# EAGLE schematic mp28164-buck-boost-flashlight-driver-tester-mk-2.1.0 (EAGLE 9.2.2)
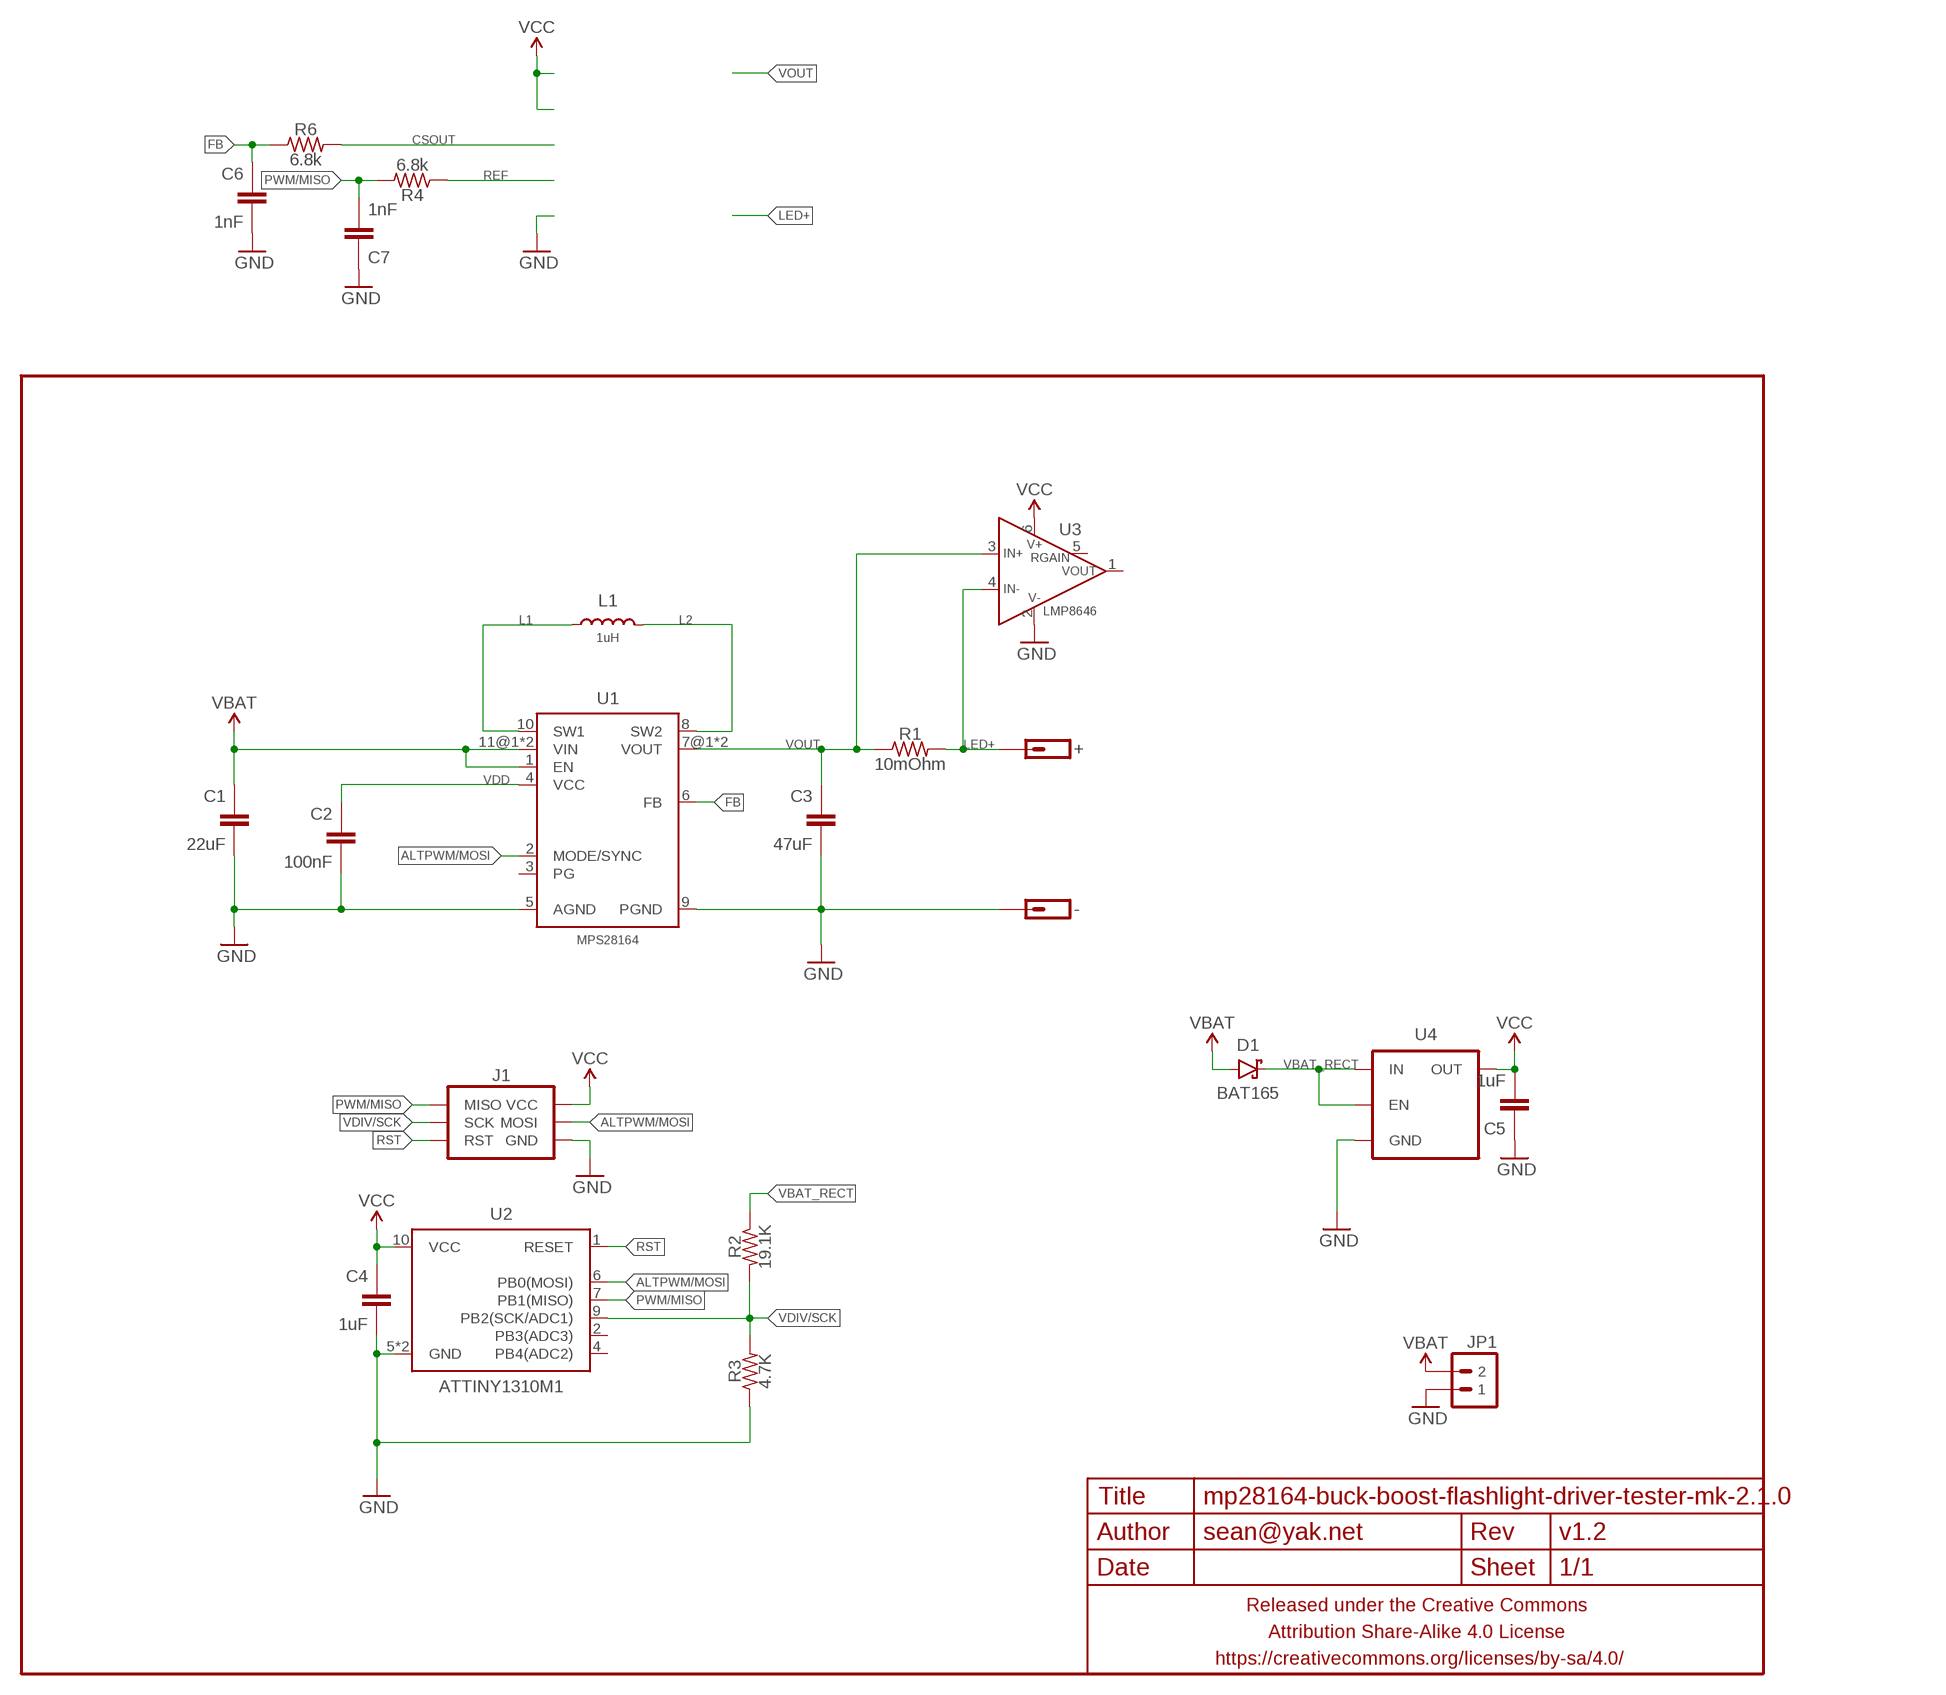
[diagram p0: schematic, sheet 1]

## Parts
+  M01PTH-1.2MM-NS  [1X01-1.2MM-NS]
-  M01PTH-1.2MM-NS  [1X01-1.2MM-NS]
C1  22uF  CAPACITOR-CERAMICC1206  [C1206]
C2  100nF  CAPACITOR-CERAMICC0402  [C0402]
C3  47uF  CAPACITOR-CERAMICC1206  [C1206]
C4  1uF  CAPACITOR-CERAMICC0402  [C0402]
C5  1uF  CAPACITOR-CERAMICC0402  [C0402]
C6  1nF  CAPACITOR-CERAMICC0402  [C0402]
C7  1nF  CAPACITOR-CERAMICC0402  [C0402]
D1  BAT165  DIODE-SCHOTTKYSOD323  [SOD323-SCHOTTKY]
FRAME1  FRAME-LETTERNO_PACKAGE  [DUMMY]
J1  AVR_SPI_PRG_6PTH  [2X3]
JP1  M02PTH-CENTERED  [1X02-CENTER]
L1  1uH  INDUCTORXAL60XX  [XAL60XX]
R1  10mOhm  RESISTORR1206  [R1206]
R2  19.1K  RESISTORR0402  [R0402]
R3  4.7K  RESISTORR0402  [R0402]
R4  6.8k  RESISTORR0402  [R0402]
R6  6.8k  RESISTORR0402  [R0402]
U1  MPS28164  [MPS28164]
U2  ATTINY1310M1  [QFN10(2X5)]
U3  LMP8646  [SOT23-6]
U4  V_REG_ENTLV700  [SC70]

## Nets
ALTPWM/MOSI: J1.4(MOSI) U1.2(MODE/SYNC) U2.6(PB0(MOSI))
CSOUT: R6.2
FB: C6.1 R6.1 U1.6(FB)
GND: -.P$1 C1.2 C2.2 C3.2 C4.2 C5.1 C6.2 C7.1 J1.6(GND) JP1.1 R3.1 U1.5(AGND) U1.9(PGND) U2.5(GND) U2.PAD(GND) U3.2(V-) U4.2(GND)
L1: L1.P$1 U1.10(SW1)
L2: L1.P$2 U1.8(SW2)
LED+: +.P$1 R1.2 U3.4(IN-)
PWM/MISO: C7.2 J1.1(MISO) R4.2 U2.7(PB1(MISO))
REF: R4.1
RST: J1.5(RST) U2.1(RESET)
VBAT: C1.1 D1.A JP1.2 U1.1(EN) U1.11@1(VIN) U1.11@2(VIN)
VBAT_RECT: D1.C R2.1 U4.1(IN) U4.3(EN)
VCC: C4.1 C5.2 J1.2(VCC) U2.10(VCC) U3.6(V+) U4.5(OUT)
VDD: C2.1 U1.4(VCC)
VDIV/SCK: J1.3(SCK) R2.2 R3.2 U2.9(PB2(SCK/ADC1))
VOUT: C3.1 R1.1 U1.7@1(VOUT) U1.7@2(VOUT) U3.3(IN+)
Unconnected: U1.3(PG) U2.2(PB3(ADC3)) U2.4(PB4(ADC2)) U3.1(VOUT) U3.5(RGAIN)

## Library data of the parts
+ - = a_parts:M01: Header 1 Standard 1-pin 0.1" header. Use with straight break away headers (SKU : PRT-00116), right angle break away headers (PRT-00553), swiss pins (PRT-00743), machine pins (PRT-00117), and female headers (PRT-00115).
C1-C7 = a_parts:CAPACITOR-CERAMIC: CAPACITOR, European symbol
D1 = a_parts:DIODE-SCHOTTKY: Schottky diodes in SFE's production catalog BAT20J 1A 23V 0.62Vf RB751 120mA 40V 0.37Vf PMEG4005EJ 0.5A 40V 0.42Vf MBRA140 1A 40V 0.5Vf B340A 3A 40V SMA
FRAME1 = a_parts:FRAME-LETTER: Schematic Frame Standard 8.5x11 US Letter frame; DESIGNER: sean@yak.net; VERSION: v1.2
J1 = a_parts:AVR_SPI_PRG_6: AVR ISP 6 Pin This is the reduced ISP connector for AVR programming. Common on Arduino. This footprint will take up less PCB space and can be used with a 10-pin to 6-pin adapter such as SKU: BOB-08508 **Special note about "TEST_POINT" package. The stop mask is on the top side, so if you want your programming test points to be on the bottom of your board, make sure to place this package on the bottom side of the board. This also ensure that the orientation to program from the bottom side will be correct.
JP1 = a_parts:M02: Standard 2-pin 0.1" header. Use with - straight break away headers ( PRT-00116) - right angle break away headers (PRT-00553) - swiss pins (PRT-00743) - machine pins (PRT-00117) - female headers (PRT-00115) Molex polarized connector foot print use with: PRT-08233 with associated crimp pins and housings. 2.54_SCREWTERM for use with PRT-10571. 3.5mm Screw Terminal footprints for PRT-08084 5mm Screw Terminal footprints for use with PRT-08433
L1 = a_parts:INDUCTOR: Inductors Basic Inductor/Choke - 0603 and 1206. Footprints are not proven and vary greatly between part numbers. SRN6045- 33uH, 20% 1.4A SDR0403-560KL - 56uH, 10%, 500mA RMS/740mA peak
R1-R4 R6 = a_parts:RESISTOR: RESISTOR, American symbol
U1 = a_parts:MPS28164
U2 = a_parts:ATTINY13: Atmel 8-pin 1kB flash uC
U3 = a_parts:LMP8646
U4 = a_parts:V_REG_EN